# EAGLE design RC Switch (EAGLE 9.6.2)
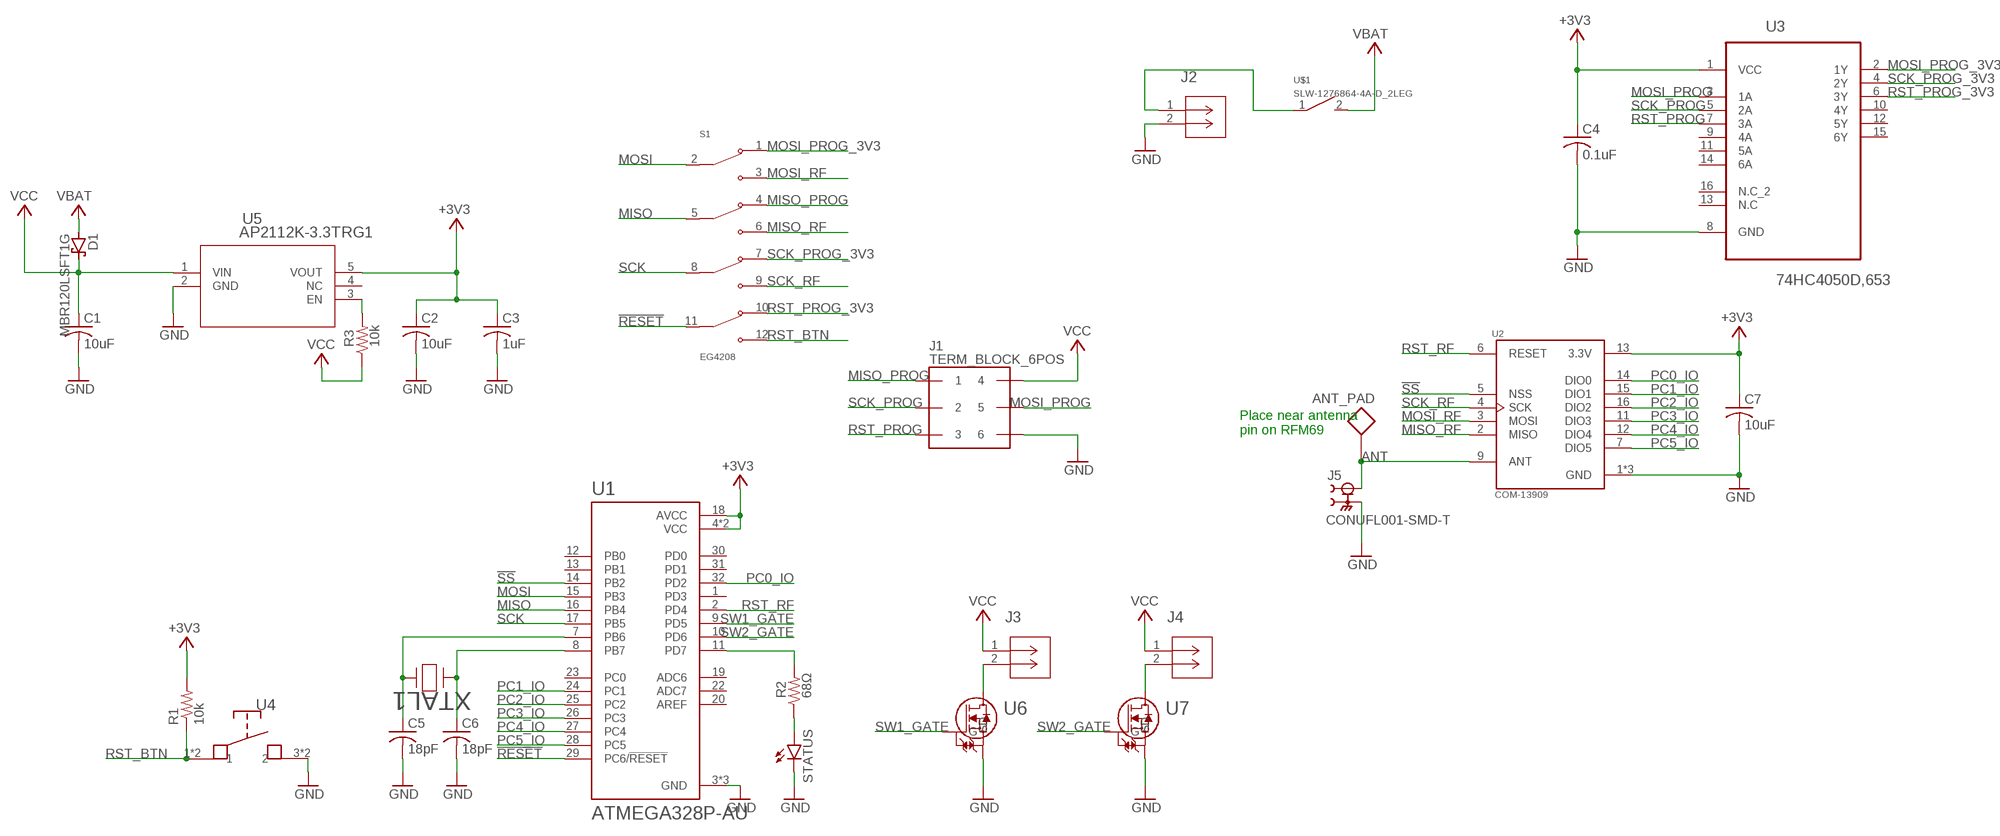
[diagram p0: schematic, sheet 1]

## Parts
ANT_PAD  CIRCLE_PAD_40MIL  [CIRCLE_PAD_40MIL]
C1  10uF  C-USC1206  [C1206]
C2  10uF  C-USC1206  [C1206]
C3  1uF  C-USC1206  [C1206]
C4  0.1uF  C-USC1206  [C1206]
C5  18pF  C-USC1206  [C1206]
C6  18pF  C-USC1206  [C1206]
C7  10uF  C-USC1206  [C1206]
D1  MBR120LSFT1G  [DIOM3616X98N]
J1  TERM_BLOCK_6POS  [TERM_BLOCK_6POS]
J2  S2B-PH-K-S(LF)(SN)  [CONN_S2B-PH-K-S_JST]
J3  691137710002  [CONN2_710002_WRE]
J4  691137710002  [CONN2_710002_WRE]
J5  CONUFL001-SMD-T  [LINX_CONUFL001-SMD-T]
R1  10k  R-US_R1206  [R1206]
R2  68Ω  R-US_R1206  [R1206]
R3  10k  R-US_R1206  [R1206]
S1  EG4208  [SW_EG4208]
STATUS  LEDCHIPLED_1206  [CHIPLED_1206]
U1  ATMEGA328P-AU  [QFP80P900X900X120-32N]
U2  COM-13909  [MOD_COM-13909]
U3  74HC4050D,653  [SOIC127P600X175-16N]
U4  PTS526_SK15_SMTR2_LFS  [SMT_FS]
U5  AP2112K-3.3TRG1  [SOT_RG1_DIO]
U6  DMN3023L-7  [SOT-23_2P9X1P3_DIO]
U7  DMN3023L-7  [SOT-23_2P9X1P3_DIO]
U$1  SLW-1276864-4A-D_2LEG  [SLW-1276864-4A-D_2LEG]
XTAL1  ABLS-8.000MHZ-B4-T  [XTAL_ABLS2_ABR]

## Nets
!RESET!: S1.11(COM4) U1.29(PC6/!RESET)
!SS!: U1.14(PB2) U2.5(NSS)
+3V3: C2.1 C3.1 C4.1 C7.1 R1.2 U1.4(VCC) U1.6(VCC) U1.18(AVCC) U2.13(3.3V) U3.1(VCC) U5.5(VOUT)
ANT: ANT_PAD.P$1 J5.1 U2.9(ANT)
GND: C1.2 C2.2 C3.2 C4.2 C5.2 C6.2 C7.2 J1.6 J2.2 J5.2 J5.3 STATUS.C U1.3(GND) U1.5(GND) U1.21(GND) U2.1(GND) U2.8(GND) U2.10(GND) U3.8(GND) U4.3 U4.4 U5.2(GND) U6.2(S) U7.2(S)
MISO: S1.5(COM2) U1.16(PB4)
MISO_PROG: J1.1 S1.4(NC2)
MISO_RF: S1.6(NO2) U2.2(MISO)
MOSI: S1.2(COM1) U1.15(PB3)
MOSI_PROG: J1.5 U3.3(1A)
MOSI_PROG_3V3: S1.1(NC1) U3.2(1Y)
MOSI_RF: S1.3(NO1) U2.3(MOSI)
N$1: J2.1 U$1.1
N$2: C5.1 U1.7(PB6) XTAL1.2
N$3: C6.1 U1.8(PB7) XTAL1.1
N$4: R2.2 U1.11(PD7)
N$5: R2.1 STATUS.A
N$6: J4.2 U7.3(D)
N$7: J3.2 U6.3(D)
N$9: R3.2 U5.3(EN)
PC0_IO: U1.32(PD2) U2.14(DIO0)
PC1_IO: U1.24(PC1) U2.15(DIO1)
PC2_IO: U1.25(PC2) U2.16(DIO2)
PC3_IO: U1.26(PC3) U2.11(DIO3)
PC4_IO: U1.27(PC4) U2.12(DIO4)
PC5_IO: U1.28(PC5) U2.7(DIO5)
RST_BTN: R1.1 S1.12(NO4) U4.1 U4.2
RST_PROG: J1.3 U3.7(3A)
RST_PROG_3V3: S1.10(NC4) U3.6(3Y)
RST_RF: U1.2(PD4) U2.6(RESET)
SCK: S1.8(COM3) U1.17(PB5)
SCK_PROG: J1.2 U3.5(2A)
SCK_PROG_3V3: S1.7(NC3) U3.4(2Y)
SCK_RF: S1.9(NO3) U2.4(SCK)
SW1_GATE: U1.9(PD5) U6.1(G)
SW2_GATE: U1.10(PD6) U7.1(G)
VBAT: D1.2(A) U$1.2
VCC: C1.1 D1.1(C) J1.4 J3.1 J4.1 R3.1 U5.1(VIN)
Unconnected: U1.1(PD3) U1.12(PB0) U1.13(PB1) U1.19(ADC6) U1.20(AREF) U1.22(ADC7) U1.23(PC0) U1.30(PD0) U1.31(PD1) U3.9(4A) U3.10(4Y) U3.11(5A) U3.12(5Y) U3.13(N.C) U3.14(6A) U3.15(6Y) U3.16(N.C_2) U5.4(NC)

## Notes on the sheet
- Place near antenna
  pin on RFM69

## Library data of the parts
ANT_PAD = Ferry:CIRCLE_PAD_40MIL
C1-C7 = rcl:C-US: CAPACITOR, American symbol; SPICEPREFIX: C
D1 = Ferry:MBR120LSFT1G
J1 = Ferry:TERM_BLOCK_6POS
J2 = Ferry:S2B-PH-K-S(LF)(SN); COPYRIGHT: Copyright (C) 2024 Ultra Librarian. All rights reserved.; MANUFACTURER_PART_NUMBER: S2B-PH-K-S(LF)(SN); MFR_NAME: JST
J3 J4 = Ferry:691137710002; COPYRIGHT: Copyright (C) 2024 Ultra Librarian. All rights reserved.; MANUFACTURER_PART_NUMBER: 691137710002; MFR_NAME: Wurth Electronics
J5 = Ferry:CONUFL001-SMD-T: Check availability <https://pricing.snapeda.com/parts/CONUFL001-SMD-T/Linx%20Technologies/view-part?ref=eda> Check availability <https://pricing.snapeda.com/parts/CONUFL001-SMD-T/Linx%20Technologies/view-part?ref=eda> Check availability <https://pricing.snapeda.com/parts/CONUFL001-SMD-T/Linx%20Technologies/view-part?ref=eda>; AVAILABILITY: In Stock; CHECK_PRICES: https://www.snapeda.com/parts/CONUFL001-SMD-T/Linx+Technologies+Inc./view-part/?ref=eda; DESCRIPTION: MHF1 Straight Surface Mount Jack, Tape and Reel; MF: Linx Technologies; MP: CONUFL001-SMD-T; PACKAGE: None; PRICE: None; PURCHASE-URL: https://www.snapeda.com/api/url_track_click_mouser/?unipart_id=1154270&manufacturer=Linx Technologies&part_name=CONUFL001-SMD-T&search_term=None; SNAPEDA_LINK: https://www.snapeda.com/parts/CONUFL001-SMD-T/Linx+Technologies+Inc./view-part/?ref=snap
R1-R3 = rcl:R-US_: RESISTOR, American symbol; SPICEPREFIX: R
S1 = Ferry:EG4208: Check availability <https://pricing.snapeda.com/parts/EG4208/E-Switch/view-part?ref=eda>; AVAILABILITY: In Stock; CHECK_PRICES: https://www.snapeda.com/parts/EG4208/E-Switch/view-part/?ref=eda; DESCRIPTION: Slide Switch, EG Series, 4PDT, ON-ON, 4mm Actuator, 200mA DC, 30VDC, R/A PC | E-Switch EG4208; MF: E-Switch; MP: EG4208; PACKAGE: None; PRICE: None; PURCHASE-URL: https://www.snapeda.com/api/url_track_click_mouser/?unipart_id=304427&manufacturer=E-Switch&part_name=EG4208&search_term=eg4208; SNAPEDA_LINK: https://www.snapeda.com/parts/EG4208/E-Switch/view-part/?ref=snap
STATUS = led:LED: LED OSRAM: - CHIPLED LG R971, LG N971, LY N971, LG Q971, LY Q971, LO R971, LY R971 LH N974, LH R974 LS Q976, LO Q976, LY Q976 LO Q996 - Hyper CHIPLED LW Q18S LB Q993, LB Q99A, LB R99A - SideLED LS A670, LO A670, LY A670, LG A670, LP A670 LB A673, LV A673, LT A673, LW A673 LH A674 LY A675 LS A676, LA A676, LO A676, LY A676, LW A676 LS A679, LY A679, LG A679 - Hyper Micro SIDELED® LS Y876, LA Y876, LO Y876, LY Y876 LT Y87S - SmartLED LW L88C, LW L88S LB L89C, LB L89S, LG L890 LS L89K, LO L89K, LY L89K LS L896, LA L896, LO L896, LY L896 - TOPLED LS T670, LO T670, LY T670, LG T670, LP T670 LSG T670, LSP T670, LSY T670, LOP T670, LYG T670 LG T671, LOG T671, LSG T671 LB T673, LV T673, LT T673, LW T673 LH T674 LS T676, LA T676, LO T676, LY T676, LB T676, LH T676, LSB T676, LW T676 LB T67C, LV T67C, LT T67C, LS T67K, LO T67K, LY T67K, LW E67C LS E67B, LA E67B, LO E67B, LY E67B, LB E67C, LV E67C, LT E67C LW T67C LS T679, LY T679, LG T679 LS T770, LO T770, LY T770, LG T770, LP T770 LB T773, LV T773, LT T773, LW T773 LH T774 LS E675, LA E675, LY E675, LS T675 LS T776, LA T776, LO T776, LY T776, LB T776 LHGB T686 LT T68C, LB T68C - Hyper Mini TOPLED® LB M676 - Mini TOPLED Santana® LG M470 LS M47K, LO M47K, LY M47K Source: http://www.osram.convergy.de LUXEON: - LUMILED® LXK2-PW12-R00, LXK2-PW12-S00, LXK2-PW14-U00, LXK2-PW14-V00 LXK2-PM12-R00, LXK2-PM12-S00, LXK2-PM14-U00 LXK2-PE12-Q00, LXK2-PE12-R00, LXK2-PE12-S00, LXK2-PE14-T00, LXK2-PE14-U00 LXK2-PB12-K00, LXK2-PB12-L00, LXK2-PB12-M00, LXK2-PB14-N00, LXK2-PB14-P00, LXK2-PB14-Q00 LXK2-PR12-L00, LXK2-PR12-M00, LXK2-PR14-Q00, LXK2-PR14-R00 LXK2-PD12-Q00, LXK2-PD12-R00, LXK2-PD12-S00 LXK2-PH12-R00, LXK2-PH12-S00 LXK2-PL12-P00, LXK2-PL12-Q00, LXK2-PL12-R00 Source: www.luxeon.com KINGBRIGHT: KA-3528ASYC Source: www.kingbright.com
U1 = Ferry:ATMEGA328P-AU: Check availability <https://pricing.snapeda.com/parts/ATMEGA328P-AU/Microchip/view-part?ref=eda>; AVAILABILITY: In Stock; CHECK_PRICES: https://www.snapeda.com/parts/ATMEGA328P-AU/Microchip/view-part/?ref=eda; DESCRIPTION: AVR AVR® ATmega Microcontroller IC 8-Bit 20MHz 32KB (16K x 16) FLASH 32-TQFP (7x7); MF: Microchip; MP: ATMEGA328P-AU; PACKAGE: TQFP-32 Microchip; PRICE: None; PURCHASE-URL: https://www.snapeda.com/api/url_track_click_mouser/?unipart_id=44280&manufacturer=Microchip&part_name=ATMEGA328P-AU&search_term=atmega328p; SNAPEDA_LINK: https://www.snapeda.com/parts/ATMEGA328P-AU/Microchip/view-part/?ref=snap
U2 = Ferry:COM-13909: Rfm69hcw Wireless Transceiver 91 Check availability <https://pricing.snapeda.com/parts/COM-13909/SparkFun%20Electronics/view-part?ref=eda>; AVAILABILITY: In Stock; CHECK_PRICES: https://www.snapeda.com/parts/COM-13909/SparkFun+Electronics/view-part/?ref=eda; DESCRIPTION: General ISM < 1GHz - Transceiver Module 915MHz - Surface Mount; MF: SparkFun Electronics; MP: COM-13909; PACKAGE: Module SparkFun Electronics; PRICE: None; PURCHASE-URL: https://www.snapeda.com/api/url_track_click_mouser/?unipart_id=4806846&manufacturer=SparkFun Electronics&part_name=COM-13909&search_term=com-13909; SNAPEDA_LINK: https://www.snapeda.com/parts/COM-13909/SparkFun+Electronics/view-part/?ref=snap
U3 = Ferry:74HC4050D,653: Hex high-to-low level shifter Check availability <https://pricing.snapeda.com/parts/74HC4050D%2C653/Nexperia%20USA%20Inc./view-part?ref=eda>; AVAILABILITY: In Stock; CHECK_PRICES: https://www.snapeda.com/parts/74HC4050D,653/Nexperia/view-part/?ref=eda; DESCRIPTION: Buffer, Non-Inverting 6 Element 1 Bit per Element Push-Pull Output 16-SO; MF: Nexperia USA Inc.; MP: 74HC4050D,653; PACKAGE: SOIC-16 Nexperia USA; PRICE: None; PURCHASE-URL: https://www.snapeda.com/api/url_track_click_mouser/?unipart_id=5558857&manufacturer=Nexperia USA Inc.&part_name=74HC4050D,653&search_term=74hc4050d; SNAPEDA_LINK: https://www.snapeda.com/parts/74HC4050D,653/Nexperia/view-part/?ref=snap
U4 = Ferry:PTS526_SK15_SMTR2_LFS; COPYRIGHT: Copyright (C) 2024 Ultra Librarian. All rights reserved.; MANUFACTURER_PART_NUMBER: PTS526 SK15 SMTR2 LFS; MFR_NAME: C&K Components
U5 = Ferry:AP2112K-3.3TRG1; COPYRIGHT: Copyright (C) 2024 Ultra Librarian. All rights reserved.; MANUFACTURER_PART_NUMBER: AP2112K-3.3TRG1; MFR_NAME: Diodes Inc
U6 U7 = Ferry:DMN3023L-7; COPYRIGHT: Copyright (C) 2024 Ultra Librarian. All rights reserved.; MANUFACTURER_PART_NUMBER: DMN3023L-7; MFR_NAME: Diodes Inc
U$1 = Ferry:SLW-1276864-4A-D_2LEG
XTAL1 = Ferry:ABLS-8.000MHZ-B4-T; COPYRIGHT: Copyright (C) 2024 Ultra Librarian. All rights reserved.; MANUFACTURER_PART_NUMBER: ABLS-8.000MHZ-B4-T; MFR_NAME: Abracon

## Board
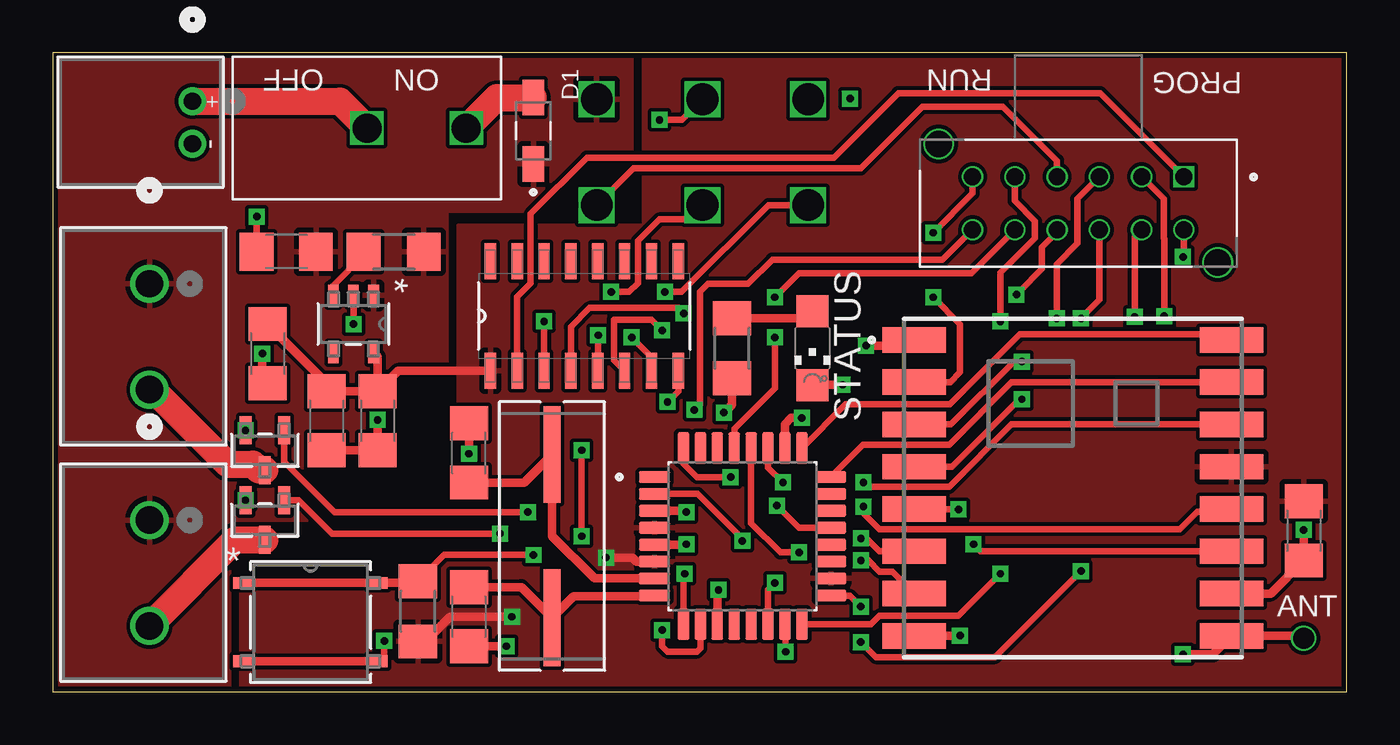
[diagram p1: board, top side]
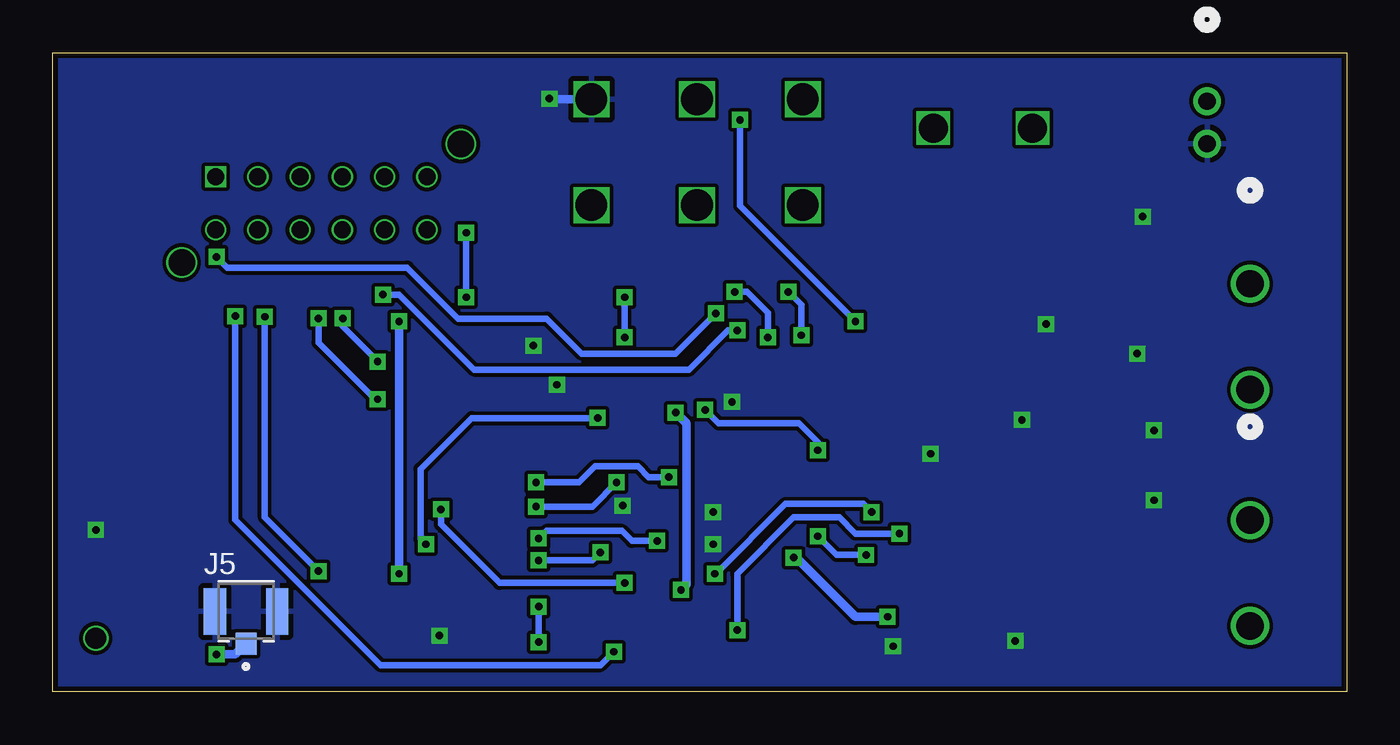
[diagram p2: board, bottom side, seen from below]

Size 61.21 x 30.23 mm. Coordinates in mm from the lower left corner, seen from the top.
Outline: 0,0 61.21,0 61.21,30.23 0,30.23 0,0
Copper layers (1*16): Top 0.0356mm / dielectric 1.5011mm / Bottom 0.0356mm
Design rules "SilverCircuits": minimum track width 7mil, minimum drill 10mil, track to track 7mil, track to pad 7mil, pad to pad 7mil, via to via 7mil, smd to smd 0mil, copper to edge 10mil, drill to drill 10mil, minimum pad ring 4mil, minimum via ring 8mil, stop-mask expansion 4mil, vias tented up to drill 0mil, thermal gap 10mil

### Footprints (pad centres in the part's own frame; a part is rotated, then mirrored left to right if it is on the bottom)
CIRCLE_PAD_40MIL = drill 1: P$1 0,0
C1206 = smd 1.6 x 1.8: 1 -1.4,0; 2 1.4,0
DIOM3616X98N = smd 1.68 x 1.01: 1 -1.57,0; 2 1.57,0
TERM_BLOCK_6POS = drill 1.5 square: 1 -2.5,5; 2 -2.5,0; 3 -2.5,-5; 4 2.5,5; 5 2.5,0; 6 2.5,-5
CONN_S2B-PH-K-S_JST = drill 0.813 pad 1.321: 1 0,0; 2 2.007,0
CONN2_710002_WRE = drill 1.295 pad 1.803: 1 0,0; 2 5.004,0
LINX_CONUFL001-SMD-T = smd 1 x 1.05: 1 0,-1.525 | smd 1.05 x 2.2: 2 -1.475,0; 3 1.475,0
R1206 = smd 1.6 x 1.803: 1 -1.422,0; 2 1.422,0
SW_EG4208 = drill 0.8 square: 1 -5,-1.25 | drill 0.8: 2 -3,-1.25; 3 -1,-1.25; 4 1,-1.25; 5 3,-1.25; 6 5,-1.25; 7 -5,1.25; 8 -3,1.25; 9 -1,1.25; 10 1,1.25; 11 3,1.25; 12 5,1.25 | drill 1.25: SH1 -6.6,2.8; SH2 6.6,-2.8
CHIPLED_1206 = smd 1.5 x 1.5: A 0,-1.75; C 0,1.75
QFP80P900X900X120-32N = smd 1.47 x 0.55: 1 -4.17,2.8; 2 -4.17,2; 3 -4.17,1.2; 4 -4.17,0.4; 5 -4.17,-0.4; 6 -4.17,-1.2; 7 -4.17,-2; 8 -4.17,-2.8; 17 4.17,-2.8; 18 4.17,-2; 19 4.17,-1.2; 20 4.17,-0.4; 21 4.17,0.4; 22 4.17,1.2; 23 4.17,2; 24 4.17,2.8 | smd 0.55 x 1.47: 9 -2.8,-4.17; 10 -2,-4.17; 11 -1.2,-4.17; 12 -0.4,-4.17; 13 0.4,-4.17; 14 1.2,-4.17; 15 2,-4.17; 16 2.8,-4.17; 25 2.8,4.17; 26 2,4.17; 27 1.2,4.17; 28 0.4,4.17; 29 -0.4,4.17; 30 -1.2,4.17; 31 -2,4.17; 32 -2.8,4.17
MOD_COM-13909 = smd 3 x 1.2: 1 -7.5,7; 2 -7.5,5; 3 -7.5,3; 4 -7.5,1; 5 -7.5,-1; 6 -7.5,-3; 7 -7.5,-5; 8 -7.5,-7; 9 7.5,-7; 10 7.5,-5; 11 7.5,-3; 12 7.5,-1; 13 7.5,1; 14 7.5,3; 15 7.5,5; 16 7.5,7
SOIC127P600X175-16N = smd 1.702 x 0.533: 1 -2.591,4.445; 2 -2.591,3.175; 3 -2.591,1.905; 4 -2.591,0.635; 5 -2.591,-0.635; 6 -2.591,-1.905; 7 -2.591,-3.175; 8 -2.591,-4.445; 9 2.591,-4.445; 10 2.591,-3.175; 11 2.591,-1.905; 12 2.591,-0.635; 13 2.591,0.635; 14 2.591,1.905; 15 2.591,3.175; 16 2.591,4.445
SMT_FS = smd 0.953 x 0.559: 1 -3.181,1.854; 2 3.181,1.854; 3 -3.181,-1.854; 4 3.181,-1.854
SOT_RG1_DIO = smd 1.003 x 0.508: 1 -1.353,0.95; 2 -1.353,0; 3 -1.353,-0.95; 4 1.353,-0.95; 5 1.353,0.95
SOT-23_2P9X1P3_DIO = smd 0.559 x 1.321: 1 -0.915,-0.94; 2 0.915,-0.94; 3 0,0.94
SLW-1276864-4A-D_2LEG = drill 1.372 square: 1 0,0; 2 -4.699,0
XTAL_ABLS2_ABR = smd 4.572 x 0.813: 1 -3.861,0; 2 3.861,0

### Placement (x,y rotation side)
ANT_PAD  59.18,2.54 0 top
C1  11.05,20.83 180 top
C2  15.37,12.83 270 top
C3  12.95,12.83 270 top
C4  10.16,16 270 top
C5  19.68,11.3 90 top
C6  19.68,3.56 270 top
C7  59.18,7.62 270 top
D1  22.73,26.54 90 top
J1  30.73,25.53 90 top
J2  6.6,27.94 270 top
J3  4.57,19.3 270 top
J4  4.57,8.13 270 top
J5  52.07,3.81 0 bottom
R1  17.27,3.81 270 top
R2  32.13,16.26 270 top
R3  16.13,20.83 180 top
S1  48.51,23.11 180 top
STATUS  35.94,16.26 180 top
U1  32.64,7.37 0 top
U2  48.26,9.65 0 top
U3  25.15,17.78 90 top
U4  12.19,3.3 0 top
U5  14.22,17.4 270 top
U6  10.03,11.43 180 top
U7  10.03,8.13 180 top
U$1  14.86,26.67 180 top
XTAL1  23.62,7.37 90 top

### Tracks (layer width: path | path; a pad name or v marks a point on that pad's centre or on a via)
!RESET!  (via drill 0.35)
  Top 0.305: U1.29 32.24,12.44 34.16,14.36 v34.16,16.76 | v34.16,18.67 35.31,19.81 43.46,19.81 S1.11
  Bottom 0.305: v34.16,16.76 v34.16,18.67
!SS!  (via drill 0.35)
  Top 0.305: U1.14 33.84,4.83 v34.16,5.16 | U2.5 42.83,8.65 v42.85,8.64
  Bottom 0.305: v34.16,5.16 40.08,5.16 42.85,7.92 v42.85,8.64
+3V3  (via drill 0.35)
  Top 0.406: C2.1 C3.1 12.95,14.61 C4.1 | U3.1 16.33,15.19 C2.1 | R1.2 17.63,2.39 18.8,3.56 v21.72,3.56 | U5.5 15.37,15.85 C2.1 | U1.6 27.62,6.17 27.43,6.35 v26.16,6.35
  Bottom 0.406: v21.72,3.56 23.24,3.56 26.04,6.35 v26.16,6.35
  pour Top: 8.89,0.25 8.89,7.62 19.18,7.62 19.18,22.1 27.94,22.1 27.94,29.97 60.96,29.97 60.96,0.25
ANT  (via drill 0.35)
  Top 0.305: 54.88,1.78
  Top 0.406: 54.88,1.78 U2.9 59.07,2.65 ANT_PAD.P$1 | v53.47,1.78 54.88,1.78
  Bottom 0.406: J5.1 52.58,1.78 v53.47,1.78
GND  (via drill 0.35)
  Top 0.305: U5.2 v14.22,17.4 | U1.21 35.3,7.77 v34.26,8.81 | U4.4 15.63,1.45 15.68,1.5 v15.68,2.41 | v9.65,22.48 C1.2 | U3.8 29.59,14.22 v29.08,13.72
  Top 0.406: U2.10 57.61,4.65 C7.2 v59.18,7.66 | U1.5 29.95,6.97 v29.97,6.99 | U1.3 29.97,8.57 v29.97,8.51 | C3.2 C2.2 v15.37,12.87 | U4.3 U4.4 | U2.8 40.77,2.67 v42.93,2.67 | C4.2 9.91,14.86 v9.91,16 | C5.2 v19.68,11.26 | v37.37,14.53 35.96,14.53 STATUS.C | C6.2 v21.46,2.16 | U2.1 40.49,16.38 v38.48,16.38
  Bottom 0.406: J1.6 37.68,28.03 v37.72,28.07
  other vias: 9.12,12.37 9.12,9.07
  pour Bottom: 0.25,29.97 0.25,0.25 60.96,0.25 60.96,29.97
MISO  (via drill 0.35)
  Top 0.305: U1.16 38.7,3.2 39.11,3.61 42.85,3.61 v44.83,5.59 | v44.83,17.53 44.83,19.82 46.47,21.47 46.47,22.26 45.51,23.22 S1.5
  Bottom 0.406: v44.83,5.59 v44.83,17.53
MISO_PROG
  Top 0.305: J1.1 27.47,24.77 38.23,24.77 41.15,27.69 44.96,27.69 47.51,25.13 S1.4
MISO_RF  (via drill 0.35)
  Top 0.305: S1.6 43.51,23.57 v41.66,21.72 | v41.66,18.67 42.93,17.4 42.93,15.11 42.47,14.65 U2.2
  Bottom 0.305: v41.66,21.72 v41.66,18.67
MOSI  (via drill 0.35)
  Top 0.305: v52.58,17.78 52.58,21.44 52.55,21.47 52.55,23.32 S1.2 | U1.15 34.67,3.16 v34.67,1.91 v34.67,1.9
  Bottom 0.305: v52.58,17.78 52.58,8.14 45.71,1.27 35.3,1.27 v34.67,1.9
MOSI_PROG  (via drill 0.35)
  Top 0.305: J1.5 29.76,27.05 v28.7,27.05 | v23.24,17.53 U3.3
  Bottom 0.305: v28.7,27.05 28.7,22.99 v23.24,17.53
MOSI_PROG_3V3
  Top 0.305: S1.1 49.56,28.32 40.01,28.32 36.96,25.27 25.27,25.27 22.61,22.61 22.61,19.33 21.97,18.7 U3.2
MOSI_RF  (via drill 0.35)
  Top 0.305: S1.3 48.47,23.32 48.47,21.21 47.5,20.24 v47.5,17.67 | U2.3 42.5,12.65 45.47,15.62 v45.85,15.62
  Bottom 0.305: v47.5,17.67 47.5,17.29 45.85,15.64 v45.85,15.62
N$1
  Top 1.27: J2.1 13.59,27.94 U$1.1
N$2
  Top 0.406: U1.7 25.62,5.37 23.62,7.37 XTAL1.2 22.3,9.9 C5.1
N$3
  Top 0.406: U1.8 28.42,4.52 24.64,4.52 XTAL1.1 22.17,4.96 C6.1
N$4  (via drill 0.35)
  Top 0.406: U1.11 31.44,4.77 v31.5,4.83 | v31.75,13.21 32.13,13.59 R2.2
  Bottom 0.406: v31.5,4.83 31.24,5.08 31.24,12.7 v31.75,13.21
N$5
  Top 0.406: R2.1 35.61,17.68 STATUS.A
N$6
  Top 1.27: U7.3 8.64,7.19 J4.2
N$7
  Top 1.27: J3.2 4.75,14.3 8.28,10.77 9.47,10.77 9.75,10.49 U6.3
N$9
  Top 0.305: R3.2 14.71,20.68 13.27,19.24 U5.3
PC0_IO  (via drill 0.35)
  Top 0.305: U2.14 45.36,12.65 42.41,9.7 38.56,9.7 v38.35,9.91 | v32.07,10.16 30.48,10.16 29.84,10.8 U1.32
  Bottom 0.305: v38.35,9.91 36.32,9.91 35.56,10.67 33.53,10.67 33.02,10.16 v32.07,10.16
PC1_IO
  Top 0.305: U1.24 38.34,11.7 42.41,11.7 45.36,14.65 U2.15
PC2_IO
  Top 0.305: U2.16 55.51,16.91 45.74,16.91 42.45,13.61 37.51,13.61 U1.25
PC3_IO  (via drill 0.35)
  Top 0.305: U2.11 43.89,6.65 v43.56,6.99
  Top 0.406: v35.43,12.96 34.93,12.96 34.64,12.67 U1.26
  Bottom 0.305: v43.56,6.99 43.81,7.24 43.81,10.54 41.4,12.95 v35.43,12.95
  Bottom 0.406: v35.43,12.95 v35.43,12.96
PC4_IO  (via drill 0.35)
  Top 0.305: U2.12 55.63,8.53 54.16,8.53 53.33,7.7 39.11,7.7 38.4,8.41 38.4,8.72 v38.35,8.76 | v34.54,9.91 33.84,10.61 U1.27
  Bottom 0.305: v38.35,8.76 35.69,8.76 v34.54,9.91
PC5_IO  (via drill 0.35)
  Top 0.305: U2.7 39.72,5.7 39.11,5.7 38.59,6.22 v38.23,6.22 | v35.31,6.6 34.42,6.6 33.04,7.98 U1.28
  Bottom 0.305: v38.23,6.22 35.69,6.22 v35.31,6.6
RST_BTN  (via drill 0.35)
  Top 0.305: S1.12 42.1,20.45 34.04,20.45 32.89,19.3 30.99,19.3 30.61,18.92 30.61,13.59 v30.35,13.34 | v25.02,7.37 v25.02,11.43 | v22.73,6.48 18.52,6.48 R1.1
  Top 0.406: R1.1 17.2,5.16 U4.2 U4.1
  Bottom 0.305: v25.02,7.37 24.13,6.48 v22.73,6.48 | v25.02,11.43 25.02,11.81 25.91,12.7 29.72,12.7 v30.35,13.34
RST_PROG  (via drill 0.35)
  Top 0.305: J1.3 33.87,23.03 29.75,18.92 v28.96,18.92 | v27.38,16.76 28.32,15.83 U3.7
  Bottom 0.305: v28.96,18.92 28.36,18.92 27.38,17.93 v27.38,16.76
RST_PROG_3V3  (via drill 0.35)
  Top 0.305: S1.10 47.51,21.74 46.8,21.03 46.8,20.01 45.72,18.92 v45.59,18.8 | v28.83,17.1 28.32,17.6 26.54,17.6 26.54,15.7 U3.6
  Bottom 0.305: v28.83,17.1 29.26,17.1 31.11,15.24 41.27,15.24 44.83,18.8 v45.59,18.8
RST_RF  (via drill 0.35)
  Top 0.305: U1.2 30.51,9.37 32.77,7.11 32.65,7.11 v32.62,7.14 | v38.23,7.26 38.51,7.26 39.12,6.65 U2.6
  Bottom 0.305: v32.62,7.14 33.81,7.14 34.29,7.62 37.85,7.62 38.2,7.26 v38.23,7.26
SCK  (via drill 0.35)
  Top 0.305: v38.23,2.36 38.93,1.65 44.58,1.65 v48.64,5.71 | v51.18,17.75 51.18,21.53 S1.8 | U1.17 36.83,4.54 37.72,4.54 v38.23,4.04
  Bottom 0.305: v48.64,5.71 51.18,8.26 v51.18,17.75 | v38.23,4.04 v38.23,2.36
SCK_PROG  (via drill 0.35)
  Top 0.305: J1.2 30.06,22.35 28.7,22.35 27.69,21.34 27.69,19.33 27.27,18.92 v26.42,18.92 | v25.8,16.87 25.8,15.21 U3.5
  Bottom 0.305: v26.42,18.92 25.8,18.3 v25.8,16.87
SCK_PROG_3V3  (via drill 0.35)
  Top 0.305: S1.7 53.51,20.62 v53.47,20.57 | v29.84,17.91 29.59,18.16 25.4,18.16 24.51,17.27 U3.4
  Bottom 0.305: v53.47,20.57 52.96,20.07 44.45,20.07 42.04,17.65 37.85,17.65 36.2,16 31.75,16 v29.84,17.91
SCK_RF  (via drill 0.35)
  Top 0.305: S1.9 49.51,18.54 v48.64,17.67 | v45.85,13.84 45.72,13.84 42.53,10.65 U2.4
  Bottom 0.305: v48.64,17.67 48.64,16.53 45.96,13.84 v45.85,13.84
SW1_GATE  (via drill 0.35)
  Top 0.305: U6.1 10.95,10.9 13.34,8.51 v22.48,8.51 | v29.89,5.59 29.84,5.54 U1.9
  Bottom 0.305: v22.48,8.51 22.86,8.89 26.54,8.89 29.84,5.59 v29.89,5.59
SW2_GATE  (via drill 0.35)
  Top 0.305: U7.1 11.63,9.07 13.21,7.49 v21.16,7.49 | v28.83,2.92 28.83,2.16 29.08,1.91 30.48,1.91 30.64,2.06 U1.10
  Bottom 0.305: v21.16,7.49 23.24,7.49 24,8.26 26.16,8.26 28.83,5.59 v28.83,2.92
VBAT
  Top 1.27: U$1.2 21,28.11 D1.2
VCC
  pour Top: 0.25,29.97 0.25,0.25 8.38,0.25 8.38,8.13 18.67,8.13 18.67,22.73 27.43,22.73 27.43,29.97

### Text on the board
tNames: OFF | ON | RUN | PROG | + | - | ANT